# EasyEDA Pro project ProProject_XIAO_NRF52833_2024-01-15.epro, board PCB4
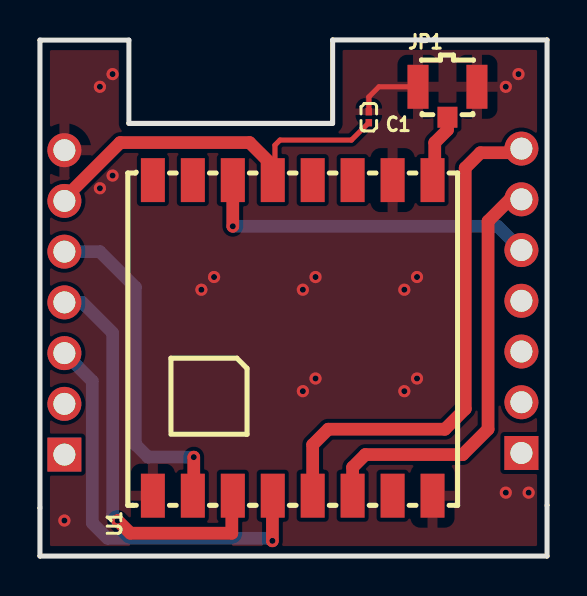
[diagram p3: board, top side]
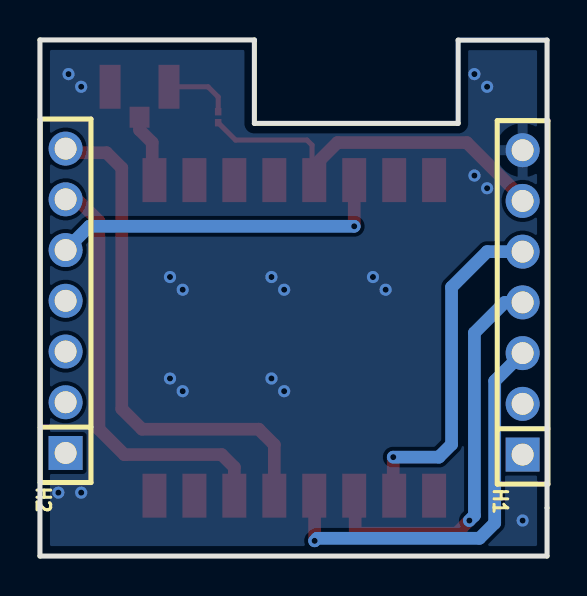
[diagram p4: board, bottom side, seen from below]

Outline 25.39 x 25.84 mm; copper layers: Top Layer, Bottom Layer. Coordinates in mm from the lower left corner of the outline.
Outline path: 0,2.41 0,25.83 4.45,25.83 4.45,21.66 14.65,21.66 14.65,25.84 25.39,25.84 25.39,0 0,0 0,2.41
Stack: Top Layer 0.035mm / Dielectric1 1.51mm FR4 er 4.5 / Bottom Layer 0.035mm

## Design rules (mm)
template: JLCPCB Capability(Two Layers Board)
spacing copperThickness1oz (default): track to track 0.102, other pairs 0.152 to 0.3
spacing copperThickness2oz: track to track 0.203, other pairs 0.152 to 0.3
track width copperThickness1oz (default): min 0.127, default 0.254, max 2.54
track width copperThickness2oz: min 0.203, default 0.254, max 2.54
differential pair differentialPair (default): width min 0.127, default 0.254, max 2.54; gap min 0.152, default 0.152
via viaSize (default): diameter min 0.5, default 0.61, max 10; hole min 0.3, default 0.305, max 6.3

## Placement (name value [footprint] x y rotation side)
C1  100nF  [C0201]  16.46 21.97 270 top
H1  PZ254V-11-07P  [HDR-TH_7P-P2.54-V-M]  1.22 12.7 90 bottom
H2  PZ254V-11-07P  [HDR-TH_7P-P2.54-V-M]  24.1 12.78 90 bottom
JP1  U.FL-R-SMT-1(80)  [RF-SMD_FRF05002-JSS103M]  20.4 22.73 0 top
U1  915MHz  [LCC-16_L16.0-W16.0-P2.00-TL]  12.65 10.92 90 top

## Footprints (pads in the part's own frame, mm; a bottom-side part is the same pattern mirrored in y, then rotated)
C0201
  rect 0.368x0.324 smd: 1(-0.275,0) 2(0.275,0)
HDR-TH_7P-P2.54-V-M
  rect 1.7x1.7 hole 1.1: 1(-7.62,0)
  round 1.7 hole 1.1: 2(-5.08,0) 3(-2.54,0) 4(0,0) 5(2.54,0) 6(5.08,0) 7(7.62,0)
LCC-16_L16.0-W16.0-P2.00-TL
  rect 2.2x1.2 smd: 1(-7.9,7) 2(-7.9,5) 3(-7.9,3) 4(-7.9,1) 5(-7.9,-1) 6(-7.9,-3) 7(-7.9,-5) 8(-7.9,-7) 9(7.9,-7) 10(7.9,-5) 11(7.9,-3) 12(7.9,-1) 13(7.9,1) 14(7.9,3) 15(7.9,5) 16(7.9,7)
RF-SMD_FRF05002-JSS103M
  rect 1x1.05 smd: 1(0,-0.762)
  rect 1.05x2.2 smd: 2(-1.475,0.762) 3(1.475,0.762)

## Nets
As in the schematic.

Pads without a net: U1 7 11 12 15 16

## Via types
v1: diameter 0.61, hole 0.305, Top Layer to Bottom Layer, 23 vias

## Routing (per net, layer and track width the routed paths; a pad name or vN(x,y) marks a point on that pad's centre or on a via; arc(x,y) is an arc through that point)
GND: length 3.4
  Top Layer w0.254: JP1.2 16.97,23.5 16.46,22.99 C1.1
  vias: v1(1.22,1.78) v1(3,23.5) v1(3,18.42) v1(3.64,24.13) v1(3.64,19.05) v1(8.08,13.34) v1(8.72,13.97) v1(13.16,13.34) v1(13.16,8.26) v1(13.8,13.97) v1(13.8,8.89) v1(18.24,13.34) v1(18.24,8.26) v1(18.88,13.97) v1(18.88,8.89) v1(23.32,23.5) v1(23.32,3.18) v1(23.96,24.13) v1(24.46,3.18)
VDD_NRF: length 19.9
  Top Layer w0.254: U1.13 11.76,18.93 11.76,20.57 12.02,20.83 15.59,20.83 C1.2
  Top Layer w0.635: U1.13 11.65,19.54 10.49,20.7 4.02,20.7 1.22,17.91 H1.6
P0.20: length 17.3
  Top Layer w0.635: U1.14 v1(9.65,16.51)
  Bottom Layer w0.635: H2.5 22.91,16.51 v1(9.65,16.51)
P0.22: length 21.5
  Top Layer w0.635: U1.6 15.65,4.45 16.29,5.08 21.16,5.08 22.43,6.35 22.43,16.76 23.53,17.86 H2.6
P0.24: length 26.2
  Top Layer w0.635: H2.7 23.9,20.19 22.05,20.19 21.29,19.43 21.29,7.37 20.27,6.35 14.43,6.35 13.65,5.57 U1.5
SCK1: length 20.7
  Top Layer w0.635: v1(11.64,0.76) 11.64,3.01 U1.4
  Bottom Layer w0.635: H1.3 2.62,8.76 2.62,1.65 3.38,0.89 11.51,0.89 v1(11.64,0.76)
SDA1: length 20.4
  Top Layer w0.635: U1.3 9.61,2.97 9.61,1.14 4.53,1.14 v1(3.89,1.78)
  Bottom Layer w0.635: v1(3.89,1.78) 3.64,2.03 3.64,11.18 2.11,12.7 H1.4
SDO1: length 17.3
  Top Layer w0.635: v1(7.7,4.95) 7.7,3.07 U1.2
  Bottom Layer w0.635: H1.5 3,15.24 4.78,13.46 4.78,5.59 5.41,4.95 v1(7.7,4.95)
$1N722: length 3.5
  Top Layer w0.635: JP1.1 20.4,21.34 19.77,20.7 19.77,18.93 U1.9

## Copper pours and planes (outline as drawn; the poured copper is in the pictures)
GND on Top Layer: -1.44,27.43 26.75,27.43 26.75,-1.27 -1.44,-1.27
GND on Bottom Layer: -2.08,28.32 27.39,28.32 27.39,-1.9 -2.08,-1.9
